# Altium schematic sheet Microcontroller.SchDoc
size A; SheetNumber: 1; SheetTotal: 2
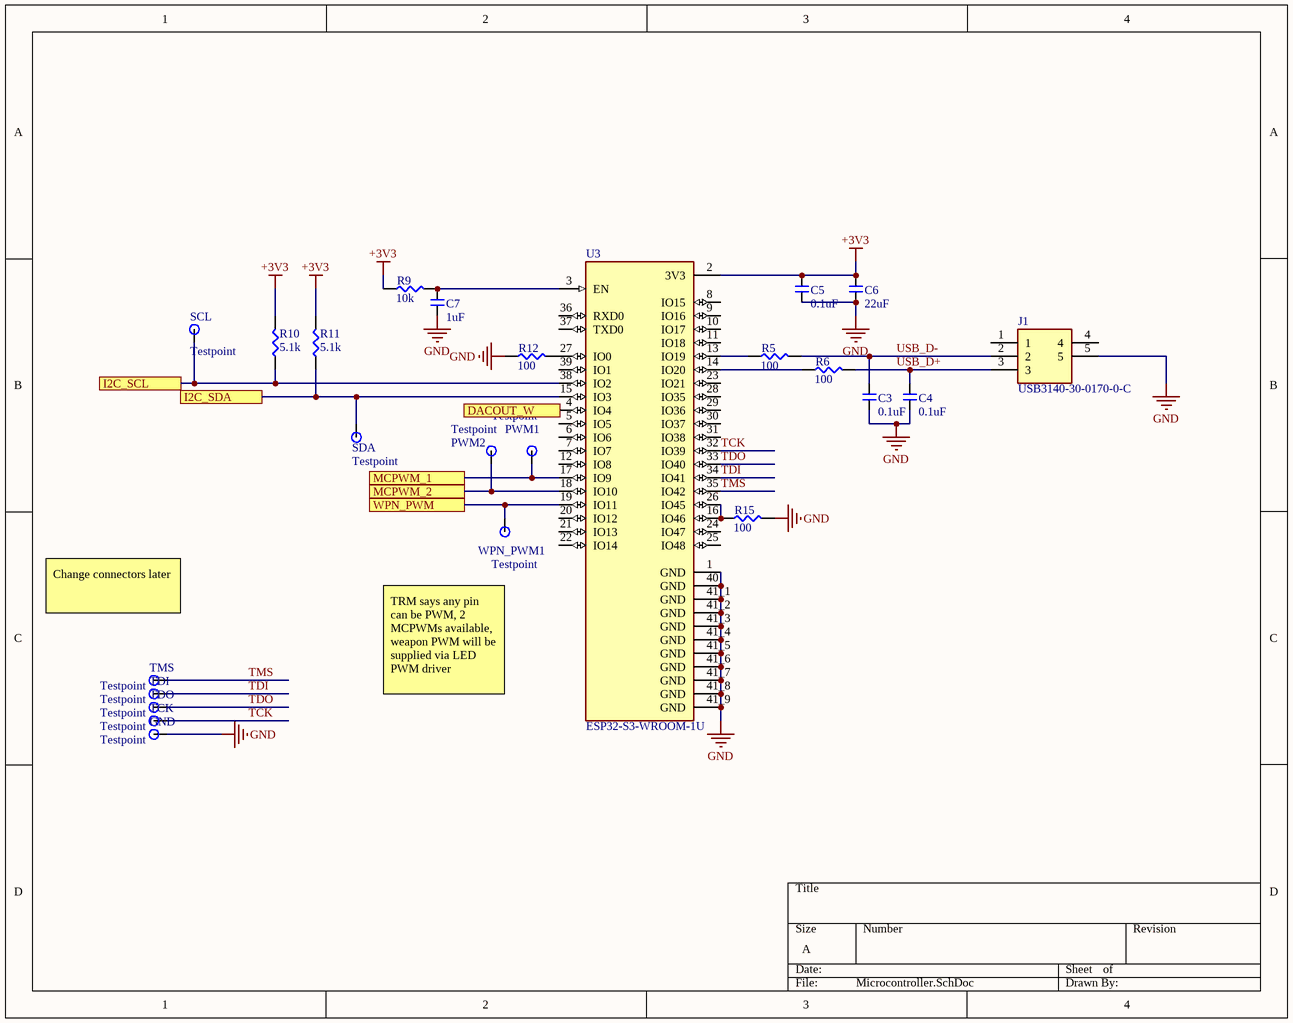
[diagram p0: Microcontroller.SchDoc]

## Parts
C3  0.1uF  [CAP-0603]
C4  0.1uF  [CAP-0603]
C5  0.1uF  [CAP-0603]
C6  22uF  [CAP-0603]
C7  1uF  [CAP-0603]
GND  Testpoint  [Testpoint]
J1  USB3140-30-0170-0-C  [USB31403001700C]
PWM1  Testpoint  [Testpoint]
PWM2  Testpoint  [Testpoint]
R5  100  [RES-0603]
R6  100  [RES-0603]
R9  10k  [RES-0603]
R10  5.1k  [RES-0603]
R11  5.1k  [RES-0603]
R12  100  [RES-0603]
R15  100  [RES-0603]
SCL  Testpoint  [Testpoint]
SDA  Testpoint  [Testpoint]
TCK  Testpoint  [Testpoint]
TDI  Testpoint  [Testpoint]
TDO  Testpoint  [Testpoint]
TMS  Testpoint  [Testpoint]
U3  ESP32-S3-WROOM-1U  [XCVR_ESP32-S3-WROOM-1U]
WPN_PWM1  Testpoint  [Testpoint]

## Ports
DACOUT_W, I2C_SCL, I2C_SDA, MCPWM_1, MCPWM_2, WPN_PWM

## Nets
+3V3: C5.2 C6.2 R9.1 R10.2 R11.2 U3.2(3V3)
GND: C3.1 C4.1 C5.1 C6.1 C7.1 GND.1 J1.5 R12.1 R15.2 U3.1(GND) U3.40(GND) U3.41_1(GND) U3.41_2(GND) U3.41_3(GND) U3.41_4(GND) U3.41_5(GND) U3.41_6(GND) U3.41_7(GND) U3.41_8(GND) U3.41_9(GND)
I2C_SCL: R10.1 SCL.1 U3.38(IO2) ; port I2C_SCL
I2C_SDA: R11.1 SDA.1 U3.15(IO3) ; port I2C_SDA
MCPWM_1: PWM1.1 U3.17(IO9) ; port MCPWM_1
MCPWM_2: PWM2.1 U3.18(IO10) ; port MCPWM_2
TCK: TCK.1 U3.32(IO39)
TDI: TDI.1 U3.34(IO41)
TDO: TDO.1 U3.33(IO40)
TMS: TMS.1 U3.35(IO42)
USB_D+: C4.2 J1.3 R6.2
USB_D-: C3.2 J1.2 R5.2
WPN_PWM: U3.19(IO11) WPN_PWM1.1 ; port WPN_PWM
NetC7_2: C7.2 R9.2 U3.3(EN)
NetR5_1: R5.1 U3.13(IO19)
NetR6_1: R6.1 U3.14(IO20)
NetR12_2: R12.2 U3.27(IO0)
NetR15_1: R15.1 U3.16(IO46) U3.26(IO45)

Not connected (* = marked no-connect by the designer): J1 1 4; U3 4(IO4) 5(IO5) 6(IO6) 7(IO7) 8(IO15) 9(IO16) 10(IO17) 11(IO18) 12(IO8) 20(IO12) 21(IO13) 22(IO14) 23(IO21) 24(IO47) 25(IO48) 28(IO35) 29(IO36) 30(IO37) 31(IO38) 36(RXD0) 37(TXD0) 39(IO1)

## Notes on the sheet
- Change connectors later
- TRM says any pin can be PWM, 2 MCPWMs available, weapon PWM will be supplied via LED PWM driver

## Library data of the parts
C3-C7 = CMP-009-000303-1: Source: ife19_Elec_Library.SchLib; Design Item ID: CAP-0603
GND PWM1 PWM2 SCL SDA TCK TDI TDO TMS WPN_PWM1 = CMP-009-000182-1: Design Item ID: Testpoint; Source: ife19_Elec_Library.SchLib
J1 = USB3140-30-0170-0-C: Connector; Manufacturer_Name: GCT (GLOBAL CONNECTOR TECHNOLOGY); Datasheet Link: https://gct.co/files/drawings/usb3140.pdf; Height: 6.7mm; Manufacturer_Part_Number: USB3140-30-0170-0-C; Mouser Part Number: 640-USB31403001700C; Mouser Price/Stock: https://www.mouser.co.uk/ProductDetail/GCT/USB3140-30-0170-0-C?qs=KUoIvG%2F9IlYQ5y%252BQm2TPIg%3D%3D
R5 R6 R9-R12 R15 = CMP-014-000032-1: Source: ife19_Elec_Library.SchLib; Design Item ID: RES-0603
U3 = CMP-218-000000-1: 2.4 GHz Wi-Fi (802.11 b/g/n) and Bluetooth 5 (LE) module; MF: Espressif Systems; Pin Count: 49; Package: Package; MP: ESP32-S3-WROOM-1U; Design Item ID: ESP32-S3-WROOM-1U; Value: *; Component Type: Standard; Availability: Not in stock; Check_prices: https://www.snapeda.com/parts/ESP32-S3-WROOM-1U/Espressif+Systems/view-part/?ref=eda; SnapEDA_Link: https://www.snapeda.com/parts/ESP32-S3-WROOM-1U/Espressif+Systems/view-part/?ref=snap; Price: None; Source: ESP32-S3-WROOM-1U.SchLib